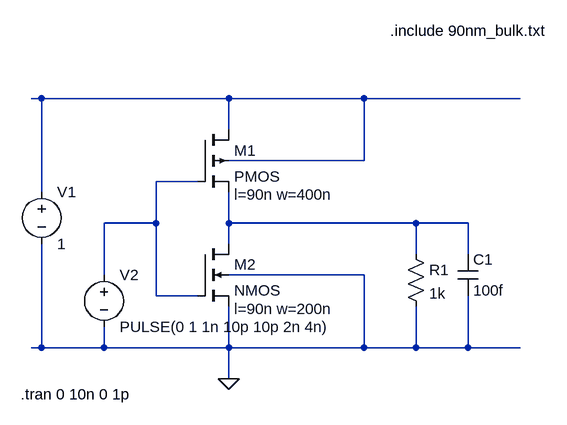
[diagram p0: schematic not_test.asc]
not_test.asc, the LTspice schematic file:
Version 4
SHEET 1 880 680
WIRE -16 -16 -32 -16
WIRE 272 -16 -16 -16
WIRE 480 -16 272 -16
WIRE 720 -16 480 -16
WIRE 272 32 272 -16
WIRE 480 80 480 -16
WIRE 480 80 272 80
WIRE 224 112 160 112
WIRE -16 128 -16 -16
WIRE 160 176 160 112
WIRE 160 176 80 176
WIRE 272 176 272 128
WIRE 560 176 272 176
WIRE 640 176 560 176
WIRE 272 208 272 176
WIRE 560 224 560 176
WIRE 640 224 640 176
WIRE 80 256 80 176
WIRE 480 256 272 256
WIRE 160 288 160 176
WIRE 224 288 160 288
WIRE -16 368 -16 208
WIRE -16 368 -32 368
WIRE 80 368 80 336
WIRE 80 368 -16 368
WIRE 272 368 272 304
WIRE 272 368 80 368
WIRE 480 368 480 256
WIRE 480 368 272 368
WIRE 560 368 560 304
WIRE 560 368 480 368
WIRE 640 368 640 288
WIRE 640 368 560 368
WIRE 720 368 640 368
WIRE 272 416 272 368
FLAG 272 416 0
SYMBOL pmos4 224 32 R0
WINDOW 123 56 100 Left 2
SYMATTR Value2 l=90n w=400n
SYMATTR InstName M1
SYMBOL voltage -16 112 R0
WINDOW 123 0 0 Left 0
WINDOW 39 0 0 Left 0
SYMATTR InstName V1
SYMATTR Value 1
SYMBOL nmos4 224 208 R0
WINDOW 123 56 100 Left 2
SYMATTR Value2 l=90n w=200n
SYMATTR InstName M2
SYMBOL res 544 208 R0
SYMATTR InstName R1
SYMATTR Value 1k
SYMBOL cap 624 224 R0
SYMATTR InstName C1
SYMATTR Value 100f
SYMBOL voltage 80 240 R0
WINDOW 123 0 0 Left 0
WINDOW 39 0 0 Left 0
SYMATTR InstName V2
SYMATTR Value PULSE(0 1 1n 10p 10p 2n 4n)
TEXT 520 -120 Left 2 !.include 90nm_bulk.txt
TEXT -48 440 Left 2 !.tran 0 10n 0 1p

The netlist it stands for:
* not_test.asc
M1 N001 N002 N003 N001 PMOS l=90n w=400n
V1 N001 0 1
M2 N003 N002 0 0 NMOS l=90n w=200n
R1 N003 0 1k
C1 N003 0 100f
V2 N002 0 PULSE(0 1 1n 10p 10p 2n 4n)
.model NMOS NMOS
.model PMOS PMOS
.lib standard.mos
.include 90nm_bulk.txt
.tran 0 10n 0 1p
.backanno
.end